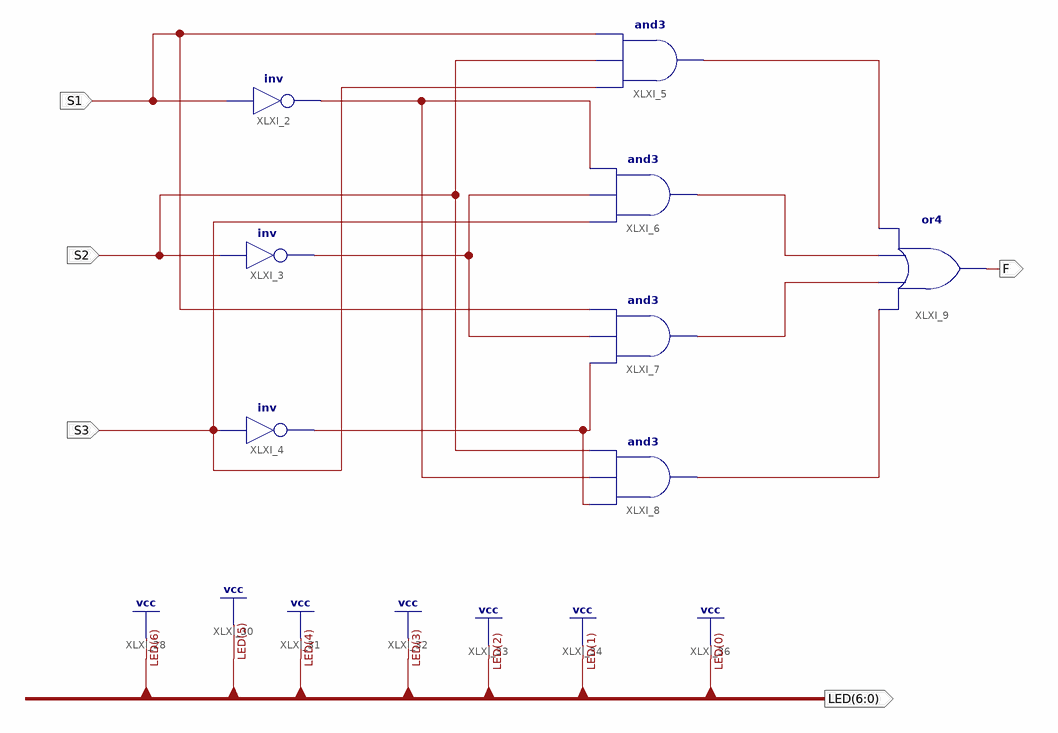
[diagram p0: schematic sheet 1]
// Xilinx ISE schematic LampCtrl.sch (kintex7) as structural Verilog: 8 symbols, 5 ports
module LampCtrl (
  input  S1,
  input  S2,
  input  S3,
  output F,
  output [6:0] LED
);

  wire XLXN_10, XLXN_11, XLXN_13, XLXN_19, XLXN_20, XLXN_21, XLXN_22;

  not XLXI_2 (XLXN_10, S1);
  not XLXI_3 (XLXN_11, S2);
  not XLXI_4 (XLXN_13, S3);
  and XLXI_5 (XLXN_19, S3, S2, S1);
  and XLXI_6 (XLXN_20, S3, XLXN_11, XLXN_10);
  and XLXI_7 (XLXN_21, XLXN_13, XLXN_11, S1);
  and XLXI_8 (XLXN_22, XLXN_13, XLXN_10, S2);
  or XLXI_9 (F, XLXN_22, XLXN_21, XLXN_20, XLXN_19);

  assign LED = {7{1'b1}};
endmodule
